# EAGLE schematic PLT-01-RevA (EAGLE 9.6.2)
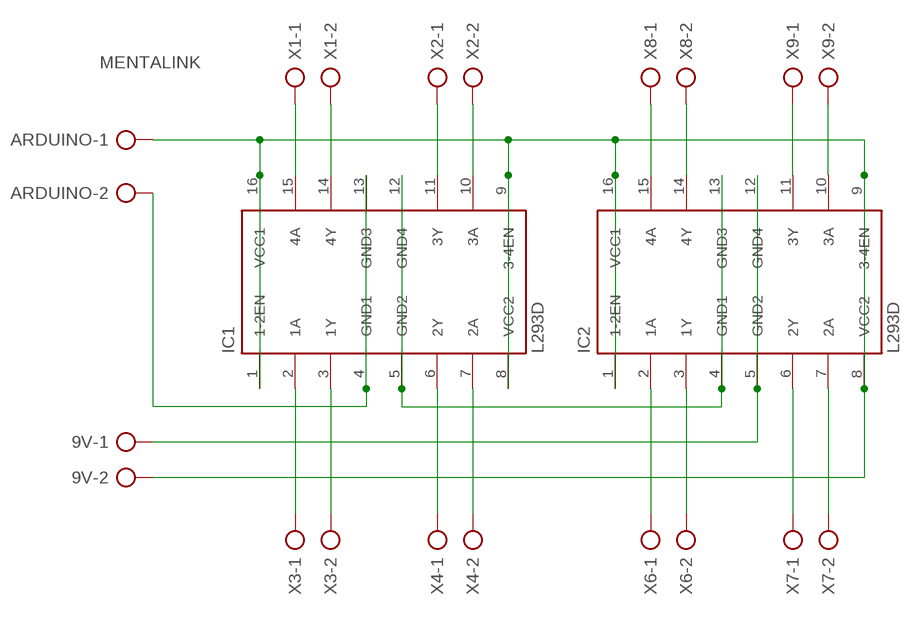
[diagram p0: schematic, sheet 1]

## Parts
9V  AK300/2  [AK300/2]
ARDUINO  AK300/2  [AK300/2]
IC1  L293D  [DIL16]
IC2  L293D  [DIL16]
X1  AK300/2  [AK300/2]
X2  AK300/2  [AK300/2]
X3  AK300/2  [AK300/2]
X4  AK300/2  [AK300/2]
X6  AK300/2  [AK300/2]
X7  AK300/2  [AK300/2]
X8  AK300/2  [AK300/2]
X9  AK300/2  [AK300/2]

## Nets
N$1: IC1.15(4A) X1.1
N$2: IC1.14(4Y) X1.2
N$3: IC1.11(3Y) X2.1
N$4: IC1.10(3A) X2.2
N$5: IC1.2(1A) X3.1
N$6: IC1.3(1Y) X3.2
N$7: IC1.6(2Y) X4.1
N$8: IC1.7(2A) X4.2
N$9: IC2.2(1A) X6.1
N$10: IC2.3(1Y) X6.2
N$11: IC2.6(2Y) X7.1
N$12: IC2.7(2A) X7.2
N$13: IC2.10(3A) X9.2
N$14: IC2.11(3Y) X9.1
N$15: IC2.15(4A) X8.1
N$16: IC2.14(4Y) X8.2
N$17: 9V.2 ARDUINO.1 IC1.1(1-2EN) IC1.8(VCC2) IC1.9(3-4EN) IC1.16(VCC1) IC2.1(1-2EN) IC2.8(VCC2) IC2.9(3-4EN) IC2.16(VCC1)
N$18: ARDUINO.2 IC1.4(GND1) IC1.13(GND3)
N$20: 9V.1 IC2.5(GND2) IC2.12(GND4)
N$21: IC1.5(GND2) IC1.12(GND4) IC2.4(GND1) IC2.13(GND3)

## Notes on the sheet
- MENTALINK

## Library data of the parts
9V ARDUINO X1-X4 X6-X9 = con-ptr500:AK300/2: CONNECTOR; OC_FARNELL: unknown; OC_NEWARK: unknown
IC1 IC2 = st-microelectronics:L293D: PUSH-PULL 4 CHANNEL DRIVER; MPN: L293D; OC_FARNELL: 9589619; OC_NEWARK: 56P8249